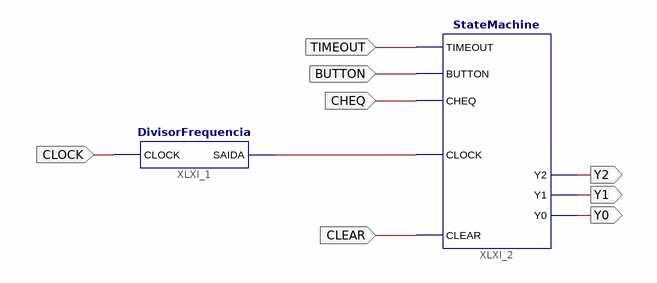
[diagram p0: schematic sheet 1]
// Xilinx ISE schematic teste_statemachine.sch (spartan3) as structural Verilog: 2 symbols, 8 ports
module teste_statemachine (
  input  CLEAR,
  input  CLOCK,
  input  CHEQ,
  input  BUTTON,
  input  TIMEOUT,
  output Y2,
  output Y1,
  output Y0
);

  wire XLXN_1;

  DivisorFrequencia XLXI_1 (.CLOCK(CLOCK), .SAIDA(XLXN_1));
  StateMachine XLXI_2 (
    .TIMEOUT(TIMEOUT), .CHEQ(CHEQ), .BUTTON(BUTTON), .CLOCK(XLXN_1), .Y2(Y2), .Y1(Y1), .Y0(Y0), .CLEAR(CLEAR));
endmodule
